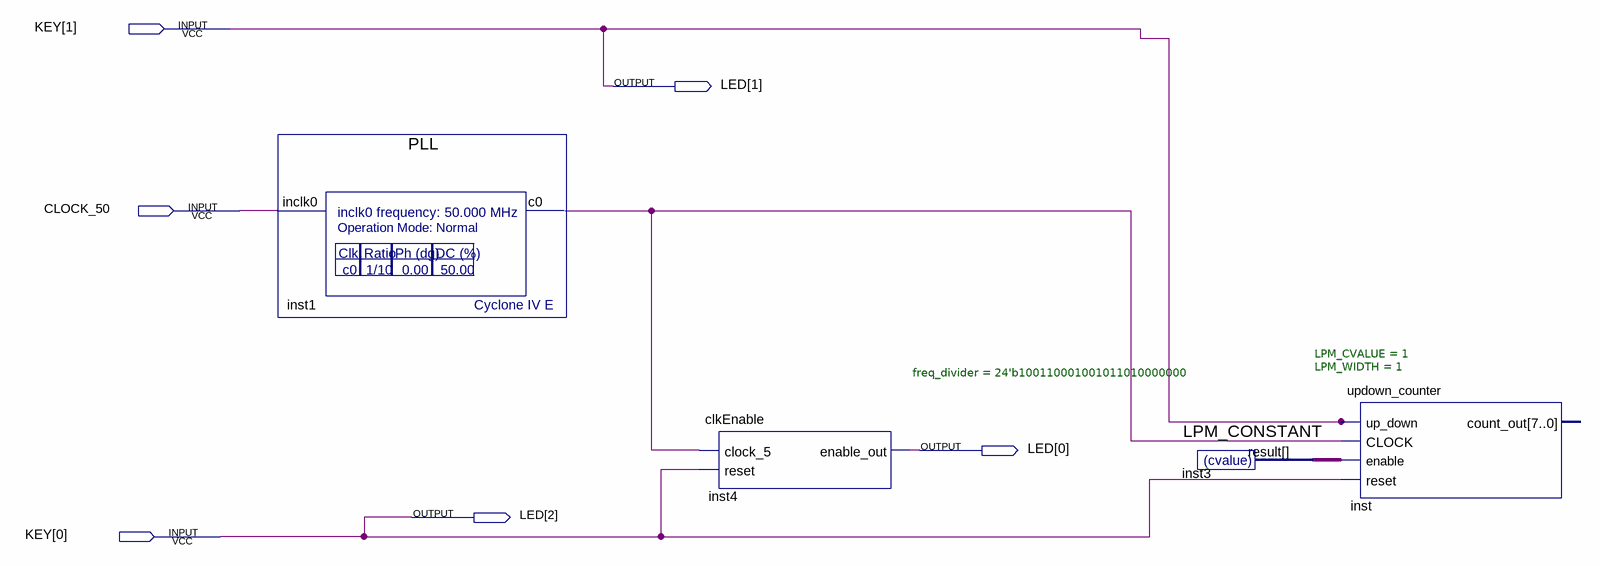
[diagram p0: schematic sheet]
// Quartus schematic 8_bit_updown_counter.bdf as structural Verilog: 4 symbols, 6 pins
module \8_bit_updown_counter  (
  input  [1:0] KEY,
  input  CLOCK_50,
  output [2:0] LED
);

  wire inst1_c0, inst3_result;

  PLL inst1 (.inclk0(CLOCK_50), .c0(inst1_c0));
  clkEnable #(.freq_divider(24'b100110001001011010000000)) inst4 (
    .clock_5(inst1_c0), .reset(KEY[0]), .enable_out(LED[0]));
  LPM_CONSTANT #(.LPM_CVALUE(1), .LPM_WIDTH(1)) inst3 (.result(inst3_result));
  updown_counter inst (.up_down(KEY[1]), .CLOCK(inst1_c0), .enable(inst3_result), .reset(KEY[0]));  // open: count_out

  assign LED[2:1] = {KEY[0], KEY[1]};
endmodule
